# EAGLE design BluetoothAUX (EAGLE 8.3.2)
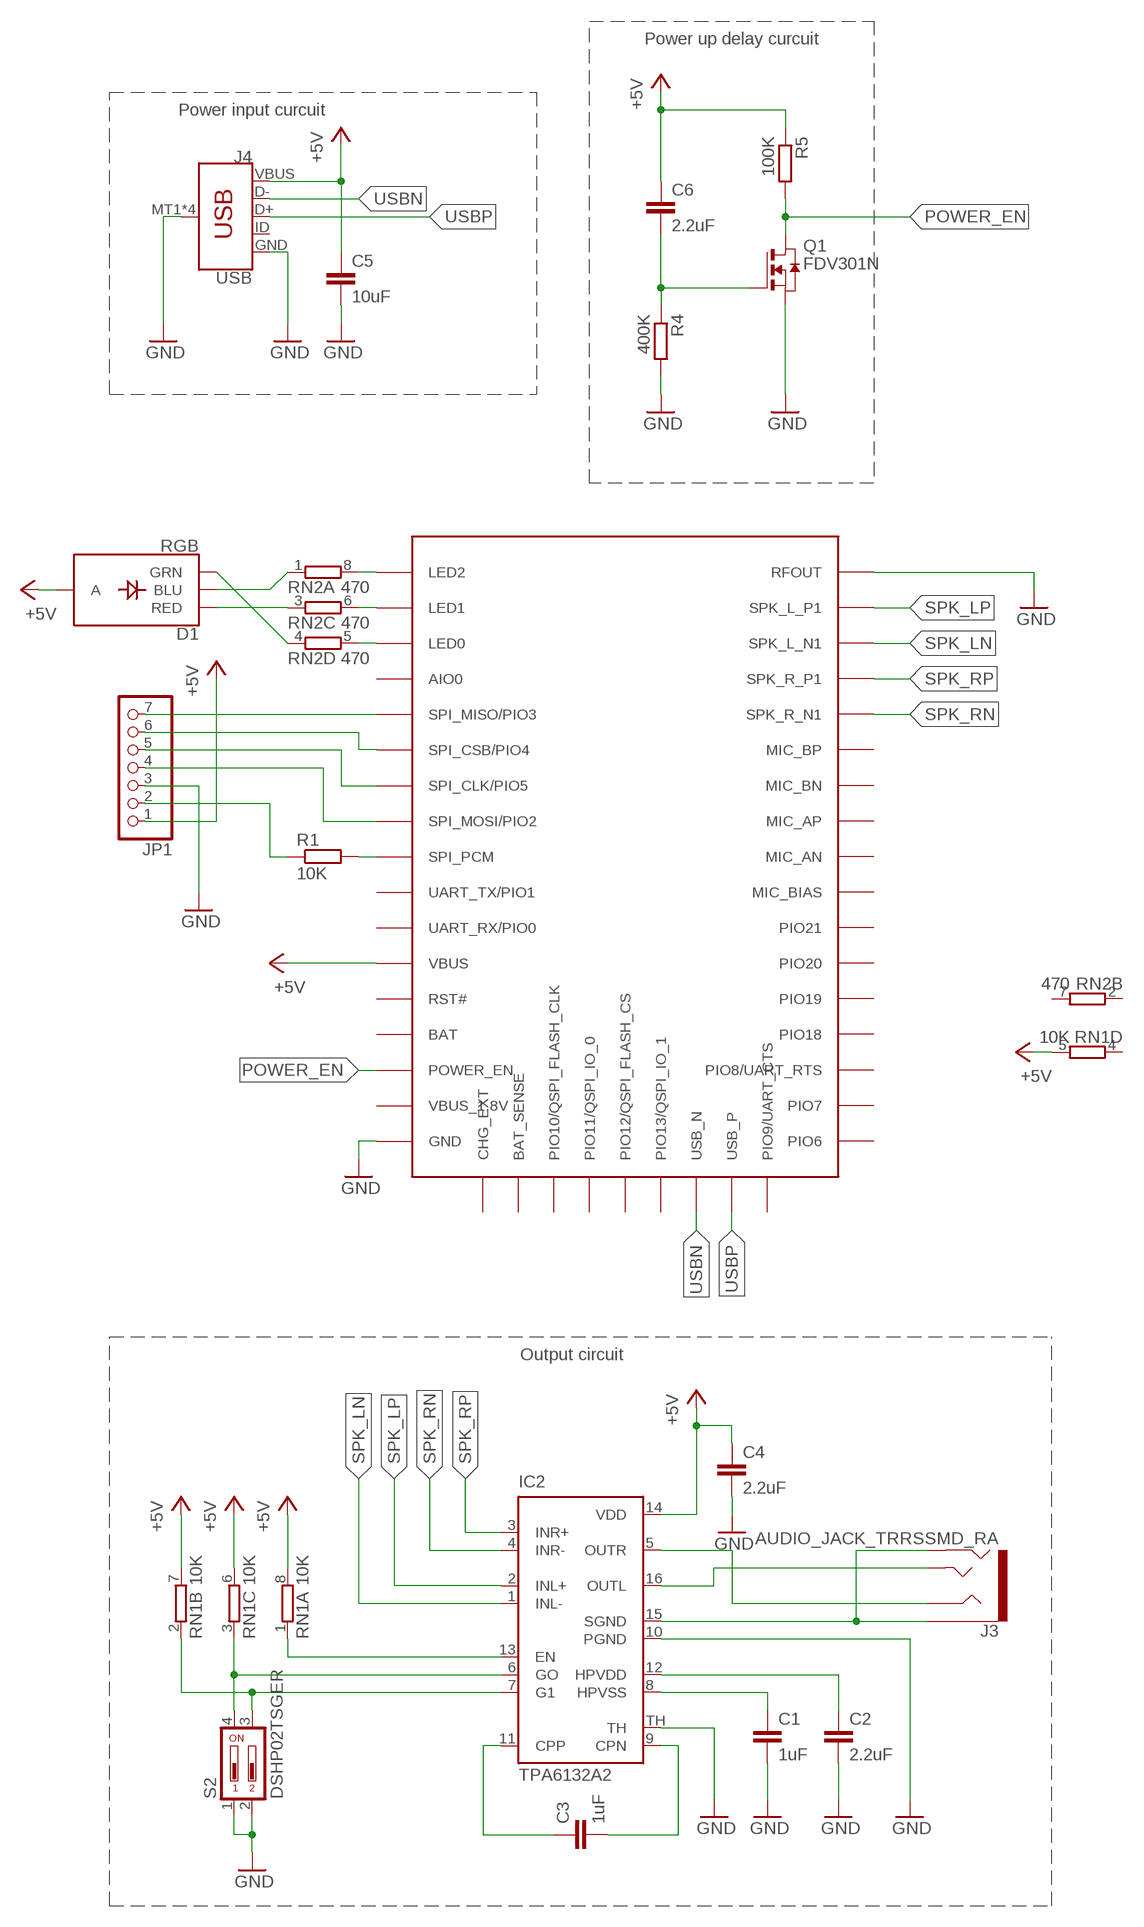
[diagram p0: schematic, sheet 1]

## Parts
C1  1uF  C-EUC0603  [C0603]
C2  2.2uF  C-EUC0603  [C0603]
C3  1uF  C-EUC0603  [C0603]
C4  2.2uF  C-EUC0603  [C0603]
C5  10uF  C-EUC1206  [C1206]
C6  2.2uF  C-EUC0603  [C0603]
D1  RGB  LED-RGB-CAPLCC  [P-LCC-4-3]
IC2  TPA6132A2  [QFN16]
J3  AUDIO_JACK_TRRSSMD_RA  [AUDIO_JACK_3.5MM_TRRS_SMD_RA]
J4  USB  USB_MICRO-B_SMT  [USB-MICROB]
JP1  PINHD-1X7  [1X07]
Q1  FDV301N  [SOT-23]
R1  10K  R-EU_R0603  [R0603]
R4  400K  R-EU_R0603  [R0603]
R5  100K  R-EU_R0603  [R0603]
RN1  10K  4R-N0603-ARC  [0603-ARC]
RN2  470  4R-N0603-ARC  [0603-ARC]
S2  DSHP02TSGER  [DSHP02TSGER]
U$1  F3188  [F3188]

## Nets
+5V [power]: C4.1 C5.1 C6.1 D1.4(A) IC2.14(VDD) J4.VBUS JP1.1 R5.1 RN1.5 RN1.6 RN1.7 RN1.8 U$1.P$12(VBUS)
BLUE: RN2.8 U$1.P$1(LED2)
CLK: JP1.5 U$1.P$7(SPI_CLK/PIO5)
CPN: C3.2 IC2.9(CPN)
CPP: C3.1 IC2.11(CPP)
CS: JP1.6 U$1.P$6(SPI_CSB/PIO4)
G0: IC2.6(GO) RN1.3 S2.4
G1: IC2.7(G1) RN1.2 S2.3
GND [power]: C1.2 C2.2 C4.2 C5.2 IC2.10(PGND) IC2.TH J4.GND J4.MT1(SHIELD) J4.MT2(SHIELD) J4.P$1(SHIELD) J4.P$2(SHIELD) JP1.3 Q1.P$2(S) R4.2 S2.1 S2.2 U$1.P$17(GND) U$1.P$43(RFOUT)
GREEN: RN2.5 U$1.P$3(LED0)
HPVSS: C1.1 IC2.8(HPVSS)
HVPDD: C2.1 IC2.12(HPVDD)
MISO: JP1.7 U$1.P$5(SPI_MISO/PIO3)
MOSI: JP1.4 U$1.P$8(SPI_MOSI/PIO2)
N$1: R1.2 U$1.P$9(SPI_PCM)
N$2: D1.2(GRN) RN2.4
N$3: D1.1(RED) RN2.3
N$4: D1.3(BLU) RN2.1
N$5: C6.2 Q1.P$1(G) R4.1
N$6: JP1.2 R1.1
OUTL: IC2.16(OUTL) J3.TIP
OUTR: IC2.5(OUTR) J3.RING1
POWER_EN: Q1.P$3(D) R5.2 U$1.P$15(POWER_EN)
RED: RN2.6 U$1.P$2(LED1)
SGND [power]: IC2.15(SGND) J3.EARTH J3.RING2
SPK_LN: IC2.1(INL-) U$1.P$41(SPK_L_N1)
SPK_LP: IC2.2(INL+) U$1.P$42(SPK_L_P1)
SPK_RN: IC2.4(INR-) U$1.P$39(SPK_R_N1)
SPK_RP: IC2.3(INR+) U$1.P$40(SPK_R_P1)
TPA_EN: IC2.13(EN) RN1.1
USBN: J4.D- U$1.P$24(USB_N)
USBP: J4.D+ U$1.P$25(USB_P)
Unconnected: J4.ID RN1.4 RN2.2 RN2.7 U$1.P$4(AIO0) U$1.P$10(UART_TX/PIO1) U$1.P$11(UART_RX/PIO0) U$1.P$13(RST#) U$1.P$18(CHG_EXT) U$1.P$19(BAT_SENSE) U$1.P$20(PIO10/QSPI_FLASH_CLK) U$1.P$21(PIO11/QSPI_IO_0) U$1.P$22(PIO12/QSPI_FLASH_CS) U$1.P$23(PIO13/QSPI_IO_1) U$1.P$26(PIO9/UART_CTS) U$1.P$27(PIO6) U$1.P$28(PIO7) U$1.P$29(PIO8/UART_RTS) U$1.P$30(PIO18) U$1.P$31(PIO19) U$1.P$32(PIO20) U$1.P$33(PIO21) U$1.P$34(MIC_BIAS) U$1.P$35(MIC_AN) U$1.P$36(MIC_AP) U$1.P$37(MIC_BN) U$1.P$38(MIC_BP)

## Notes on the sheet
- Power up delay curcuit
- Power input curcuit
- Output circuit

## Power pins joined to a net without a drawn wire
BAT: U$1.P$14(BAT)
VBUS_1.8V: U$1.P$16(VBUS_1.8V)

## Library data of the parts
C1-C4 C6 = resistor:C-EU: CAPACITOR, European symbol
C5 = rcl:C-EU: CAPACITOR, European symbol
D1 = SparkFun-LED:LED-RGB-CA: LED-RGB Diffused Common Anode Packages: LED RGB-THRU P-LCC-4-3 LED-TRICOLOR-SMD SparkFun Products: RGB Diffused Common Anode- Diffuse <[https://www.sparkfun.com/products/10821]> RGB Diffused Common Anode - Clear <[https://www.sparkfun.com/products/10820]> Qduino Mini <[https://www.sparkfun.com/products/13614]> Triple Output LED RGB - SMD <https://www.sparkfun.com/products/7844>; PROD_ID: DIO-12986
IC2 = texas:TPA6132A2: 25-mW DIRECTPATH (TM) STEREO HEADPHONE AMPLIFIER WITH POP SUPPRESSION Source: www.ti.com .. tpa6132a2 direct path stereo $.65.pdf; MPN: TPA6132A2RTET; OC_FARNELL: 1697167; OC_NEWARK: 46P3781
J3 = SparkFun-Connectors:AUDIO_JACK_TRRS: Audio Jack - 3.5mm TRRS (SMD) This is a 3.5mm TRRS SMD audio jack. TRRS connectors are the audio-style connectors that you see on some phones, MP3 players and development boards. TRRS stands for “tip, ring, ring, sleeve,” which reflects that this has three conductors and a ground. SparkFun Products: Audio Jack <https://www.sparkfun.com/products/12639> mbed Starter Kit <https://www.sparkfun.com/products/12968> SparkFun TRRS 3.5mm Jack Breakout <https://www.sparkfun.com/products/11570>; PROD_ID: CONN-10676; SF_ID: PRT-12639
J4 = SparkFun-Connectors:USB_MICRO-B: USB Type Micro-B Connector Male/female and PTH/SMT variants SparkFun Products: SparkFun microB USB Breakout <https://www.sparkfun.com/products/12035> SparkFun USB microB Plug Breakout <https://www.sparkfun.com/products/10031> SparkFun ESP8266 Thing <https://www.sparkfun.com/products/13231>; PROD_ID: CONN-09505; SF_ID: PRT-08533
JP1 = pinhead:PINHD-1X7: PIN HEADER
Q1 = FDV301N:FDV301N: Digital FET, N-Channel This device has been designed especially for low voltage applications as a replacement for digital transistors. 25 V, 0.22 A continuous. 0.5 A peak Rds(on) < 5R @ Vgs 2.7 V. Datasheet <http://datasheet.octopart.com/FDV301N-Fairchild-datasheet-8330556.pdf>; AVAILABILITY: Good; DESCRIPTION: FD V301N Series N-Channel 25 V 4 Ohm Surface Mount Digital FET - SOT-23-3; MF: Fairchild Semiconductor; MP: FDV301N; PACKAGE: SOT-23 Fairchild Semiconductor; PRICE: 0.06 USD
R1 R4 R5 = resistor:R-EU_: RESISTOR, European symbol
RN1 RN2 = resistor-dil:4R-N: Array Chip Resistor Source: RS Component / Phycomp; OC_FARNELL: unknown; OC_NEWARK: unknown
S2 = BluetoothAUX:DSHP02TSGER: Surface Mount DIP Switch Series 219 SMT CTS Electronic Components Sourc: www.ctscorp.com; OC_FARNELL: unknown; OC_NEWARK: unknown
U$1 = BluetoothAUX:F3188

## Net classes
1 power: width 0.305 mm

## Board
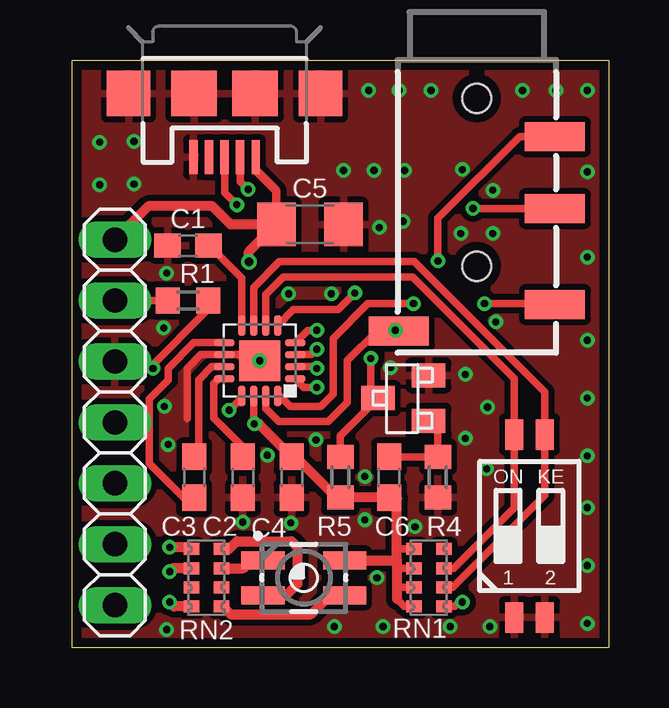
[diagram p1: board, top side]
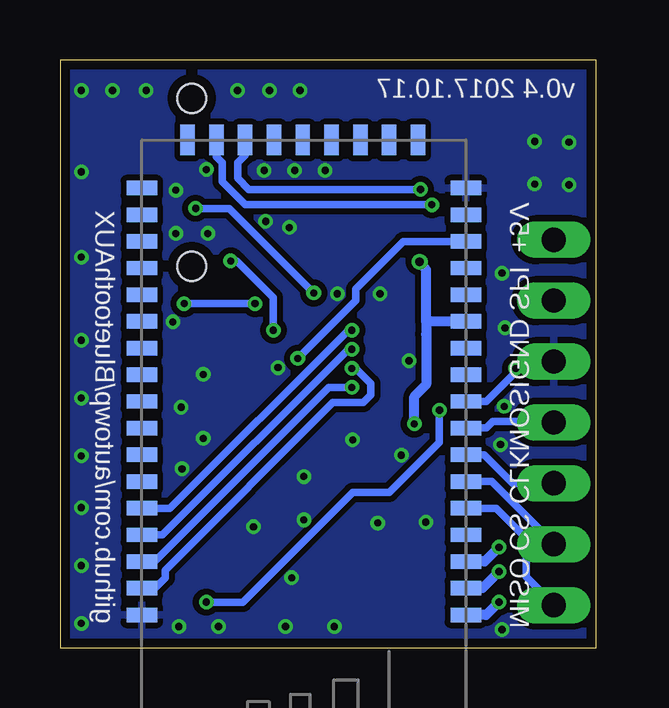
[diagram p2: board, bottom side, seen from below]

Size 22.35 x 24.51 mm. Coordinates in mm from the lower left corner, seen from the top.
Outline: 22.35,0 0,0 0,24.51 22.35,24.5 22.35,0
Copper layers (1*16): Top 0.035mm / dielectric 1.5mm / Bottom 0.035mm
Design rules "NOA Eagle Rule 2016-06-12 *": minimum track width 6mil, minimum drill 0.3mm, track to track 6mil, track to pad 6mil, pad to pad 6mil, via to via 6mil, smd to smd 0mil, copper to edge 0.4mm, drill to drill 10mil, minimum pad ring 10mil, minimum via ring 6mil, stop-mask expansion 2mil, vias tented up to drill 25mil, thermal gap 10mil

### Footprints (pad centres in the part's own frame; a part is rotated, then mirrored left to right if it is on the bottom)
C0603 = smd 1.1 x 1: 1 -0.85,0; 2 0.85,0
C1206 = smd 1.6 x 1.8: 1 -1.4,0; 2 1.4,0
P-LCC-4-3 = smd 1.8 x 0.75: 1 -1.7,0.725; 2 -1.7,-0.725; 3 1.7,-0.725; 4 1.7,0.725
QFN16 = smd 0.85 x 0.3: 1 -1.475,0.75; 2 -1.475,0.25; 3 -1.475,-0.25; 4 -1.475,-0.75; 9 1.475,-0.75; 10 1.475,-0.25; 11 1.475,0.25; 12 1.475,0.75 | smd 0.3 x 0.85: 5 -0.75,-1.475; 6 -0.25,-1.475; 7 0.25,-1.475; 8 0.75,-1.475; 13 0.75,1.475; 14 0.25,1.475; 15 -0.25,1.475; 16 -0.75,1.475 | smd 1.7 x 1.7: TH 0,0
AUDIO_JACK_3.5MM_TRRS_SMD_RA = smd 1.2 x 2.5: EARTH 11.3,-3.25; RING1 6.2,3.25; RING2 3.2,3.25; TIP 10.2,3.25 | hole 1.2: 1.6,0; 8.6,0
USB-MICROB = smd 1.4 x 0.35: D+ -2.65,0; D- -2.65,-0.65; GND -2.65,1.3; ID -2.65,0.65; VBUS -2.65,-1.3 | smd 1.9 x 1.8: MT1 0,-4; MT2 0,4 | smd 1.9 x 1.9: P$1 0,-1.27; P$2 0,1.27
1X07 = drill 1.016 long: 1 -7.62,0; 2 -5.08,0; 3 -2.54,0; 4 0,0; 5 2.54,0; 6 5.08,0; 7 7.62,0
SOT-23 = smd 1 x 1.4: P$1 -0.95,-1.1; P$2 0.95,-1.1; P$3 0,1
R0603 = smd 1 x 1.1: 1 -0.85,0; 2 0.85,0
0603-ARC = smd 0.5 x 0.65: 1 -1.2,-0.625; 2 -0.4,-0.625; 3 0.4,-0.625; 4 1.2,-0.625; 5 1.2,0.625; 6 0.4,0.625; 7 -0.4,0.625; 8 -1.2,0.625
DSHP02TSGER = smd 0.76 x 1.27: 1 -0.635,-3.81; 2 0.635,-3.81; 3 0.635,3.81; 4 -0.635,3.81
F3188 = smd 1.27 x 0.6: P$1 -6.5,7.9; P$2 -6.5,6.787; P$3 -6.5,5.675; P$4 -6.5,4.562; P$5 -6.5,3.45; P$6 -6.5,2.337; P$7 -6.5,1.225; P$8 -6.5,0.113; P$9 -6.5,-1; P$10 -6.5,-2.112; P$11 -6.5,-3.225; P$12 -6.5,-4.338; P$13 -6.5,-5.45; P$14 -6.5,-6.562; P$15 -6.5,-7.675; P$16 -6.5,-8.787; P$17 -6.5,-9.9; P$27 7,-9.9; P$28 7,-8.787; P$29 7,-7.675; P$30 7,-6.562; P$31 7,-5.45; P$32 7,-4.338; P$33 7,-3.225; P$34 7,-2.112; P$35 7,-1; P$36 7,0.113; P$37 7,1.225; P$38 7,2.337; P$39 7,3.45; P$40 7,4.562; P$41 7,5.675; P$42 7,6.787; P$43 7,7.9 | smd 0.6 x 1.27: P$18 -4.5,-11.9; P$19 -3.3,-11.9; P$20 -2.1,-11.9; P$21 -0.9,-11.9; P$22 0.3,-11.9; P$23 1.5,-11.9; P$24 2.7,-11.9; P$25 3.9,-11.9; P$26 5.1,-11.9

### Placement (x,y rotation side)
C1  4.83,16.76 180 top
C2  7.11,7.11 270 top
C3  5.08,7.11 270 top
C4  9.14,7.11 270 top
C5  9.91,17.65 0 top
C6  13.21,7.11 90 top
D1  9.65,2.92 0 top
IC2  7.81,11.97 180 top
J3  16.86,24.51 270 top
J4  6.35,23.11 90 top
JP1  1.78,9.4 270 top
Q1  13.75,10.41 90 top
R1  4.83,14.48 0 top
R4  15.24,7.11 270 top
R5  11.18,7.11 90 top
RN1  14.86,2.92 90 top
RN2  5.59,2.92 90 top
S2  19.05,5.08 0 top
U$1  11.94,9.27 180 bottom

### Tracks (layer width: path | path; a pad name or v marks a point on that pad's centre or on a via)
+5V  (via drill 0.3, 0.35)
  Top 0.305: 7.56,10.03 IC2.14 7.56,9.36 v7.59,9.34 | 8.32,18 C5.1 8.32,18.1 8.13,18.29 | 13.52,6.22 13.46,6.22 | RN1.8 13.84,1.72 13.52,2.03 | RN1.7 13.63,2.52 13.52,2.67 | RN1.6 13.67,3.32 13.52,3.43 | RN1.5 13.71,4.12 13.52,4.19
  Top 0.356: J4.VBUS 7.65,19.91 8.51,19.05 C5.1
  Top 0.406: 8.16,18.32 8.13,18.29 | 13.46,6.22 C6.1 R5.1 11.01,6.26 9.31,7.96 C4.1 8.9,8.22 7.78,9.34 v7.59,9.34 | 13.52,2.03 13.52,2.67 13.52,3.43 13.52,3.65 | 13.52,3.65 13.52,4.19 13.52,6.22 | 11.18,3.72 D1.4 13.52,3.65 | v7.37,16.1 7.37,16.51 C5.1 6.6,17.65 5.84,18.42 3.17,18.42 JP1.1
  Bottom 0.406: v7.37,16.1 7.37,16.04 7.09,15.77 7.09,13.61 | v7.59,9.34 7.59,10.48 7.09,10.97 7.09,13.08 7.09,13.61 | U$1.P$12 7.09,13.61
BLUE  (via drill 0.3)
  Top 0.406: RN2.8 4.25,1.72 v4.06,1.91
  Bottom 0.406: v4.06,1.91 4.6,1.37 U$1.P$1
CLK
  Bottom 0.305: U$1.P$7 4.68,8.05 3.49,6.86 JP1.5
CPN
  Top 0.305: IC2.9 5.07,12.72 4,11.65 4,11.18 3.21,10.38 3.21,7.68 4.63,6.26 C3.2
CPP
  Top 0.305: IC2.11 5.81,11.72 5.27,11.18 5.27,8.47 C3.1
CS
  Bottom 0.305: U$1.P$6 4.36,6.93 1.78,4.35 JP1.6
G0
  Top 0.305: IC2.6 8.06,14.73 8.8,15.46 14.19,15.46 18.41,11.24 S2.4 18.41,5.84 15.89,3.32 RN1.3
G1
  Top 0.305: IC2.7 7.56,15.02 8.64,16.1 14.26,16.1 19.68,10.67 S2.3 19.68,6.35 15.86,2.52 RN1.2
GND  (via drill 0.3)
  Top 0.305: IC2.TH 7.56,12.22 IC2.10 5.36,12.22 4.79,11.65 4.79,9.56
  other vias: 14.95,23.24 16.26,19.94 13.62,23.24 12.35,23.24 20.16,23.24 12.57,19.91 17.53,17.27 21.46,23.24 16.19,17.27 3.84,10.06 1.14,19.3 1.14,21.08 18.76,23.24 21.46,3.43 21.46,5.84 13.27,11.68 7.11,5.24 15.75,0.89 7.81,11.97 14.29,5.05 13.78,17.78 17.53,19.08 2.57,19.34 11.3,19.91 13.84,19.91 12.95,0.89 8.13,8.03 9.11,5.21 4,8.48 12.8,17.53 17.4,0.89 17.3,10.03 21.46,1.02 10.92,0.89 21.46,8 21.46,12.83 21.46,10.41 16.38,11.4 16.38,8.73 17.27,7.46 21.46,19.84 21.46,16.29 10.16,8.67 12.19,7.14 9.02,14.76 10.8,14.76 12.19,5.33 17.65,13.59 12.7,2.92 2.57,21.11 3.94,15.62 3.81,13.33 3.94,0.76
  pour Bottom (isolate 0.254): 22.35,24.51 0,24.51 0,0 22.35,0
  pour Top (isolate 0.254): 22.35,0 22.35,24.51 0,24.51 0,0
GREEN  (via drill 0.3)
  Top 0.406: RN2.5 4.89,4.19 v4.06,4.19
  Bottom 0.406: v4.06,4.19 4.66,3.6 U$1.P$3
HPVSS
  Top 0.305: 7.06,13.92 IC2.8 7.06,15.42 5.71,16.76 C1.1
HVPDD
  Top 0.305: IC2.12 6.11,11.22 5.91,11.02 5.91,9.59 7.15,8.34 C2.1
MISO
  Bottom 0.305: U$1.P$5 4.17,5.82 2.92,4.57 2.92,2.95 1.78,1.81 JP1.7
  Bottom 0.406: 5.4,5.78 U$1.P$5
MOSI
  Bottom 0.305: U$1.P$8 4.59,9.16 4.32,9.43 1.81,9.43 JP1.4
N$1  (via drill 0.3)
  Top 0.305: v3.37,11.65 3.21,11.65 5.68,14.12 R1.2
  Bottom 0.305: U$1.P$9 4.59,10.27 3.37,11.49 v3.37,11.65
N$2
  Top 0.406: RN2.4 6.53,4.12 6.86,4.45 9.14,4.45 9.4,4.19 9.4,2.67 8.93,2.2 D1.2
N$3
  Top 0.406: RN2.3 7.13,3.32 7.37,3.56 7.86,3.56 D1.1
N$4
  Top 0.305: 10.76,2.2 D1.3
  Top 0.406: RN2.1 6.28,1.72 6.6,1.4 9.96,1.4 10.76,2.2
N$5
  Top 0.305: C6.2 R4.1 15.24,9.07 Q1.P$1
N$6
  Top 0.305: R1.1 JP1.2
OUTL  (via drill 0.3)
  Top 0.305: IC2.16 8.65,10.5 9.08,10.07 10.35,10.07 10.87,10.59 10.87,12.91 12.32,14.35 v14.22,14.35 | J3.TIP 20.62,14.35 v17.18,14.35
  Bottom 0.305: v14.22,14.35 v17.18,14.35
OUTR  (via drill 0.3)
  Top 0.305: J3.RING1 17.01,18.31 v16.7,18.32 | IC2.5 9.21,14.1 11.08,14.1 v11.78,14.8
  Bottom 0.305: v16.7,18.32 15.3,18.32 v11.78,14.8
POWER_EN  (via drill 0.3)
  Top 0.305: R5.2 11.18,8.84 Q1.P$3 | Q1.P$3 13.08,10.41 | Q1.P$3 12.45,10.72 v12.45,12.07
  Bottom 0.305: U$1.P$15 8.04,16.95 10.03,14.95 10.03,14.48 v12.45,12.07
RED  (via drill 0.3)
  Top 0.406: RN2.6 4.21,3.32 v4.06,3.18
  Bottom 0.406: v4.06,3.18 4.76,2.48 U$1.P$2
SGND  (via drill 0.3)
  Top 0.305: 8.06,10.18 IC2.15 8.06,9.97 8.6,9.43 10.67,9.43 11.46,10.22 11.46,11.97 12.73,13.24 v13.46,13.24 14.21,13.24 J3.EARTH | J3.RING2 18.64,21.31 15.24,17.91 v15.24,16.13
  Bottom 0.305: v15.24,16.13 14.99,16.13 13.46,14.61 v13.46,13.24
SPK_LN  (via drill 0.3)
  Top 0.305: IC2.1 9.65,10.86 v10.19,10.86
  Bottom 0.305: v10.19,10.86 11.14,10.86 18.41,3.6 U$1.P$41
SPK_LP  (via drill 0.3)
  Top 0.305: IC2.2 10.12,11.72 v10.19,11.65
  Bottom 0.305: v10.19,11.65 10.03,11.65 9.4,11.02 9.4,10.54 9.71,10.22 10.99,10.22 17.97,3.24 17.97,2.92 18.41,2.48 U$1.P$42
SPK_RN  (via drill 0.3)
  Top 0.305: IC2.4 9.81,13.24 v10.19,13.24
  Bottom 0.305: v10.19,13.24 10.35,13.24 17.77,5.82 U$1.P$39
SPK_RP  (via drill 0.3)
  Top 0.305: IC2.3 9.96,12.22 v10.19,12.45
  Bottom 0.305: v10.19,12.45 10.35,12.45 18.09,4.71 U$1.P$40
TPA_EN  (via drill 0.3)
  Top 0.305: IC2.13 7.06,10.43 v6.54,9.91 | v16.26,1.91 16.19,1.98 15.93,1.72 RN1.1
  Bottom 0.305: v16.26,1.91 14.73,1.91 10.16,6.48 8.64,6.48 6.54,8.57 v6.54,9.91
USBN  (via drill 0.3)
  Top 0.305: J4.D- 7,19.45 v7.33,19.11
  Bottom 0.305: v7.33,19.11 14.48,19.11 14.95,19.59 14.95,20.22 14.64,20.54 U$1.P$24
USBP  (via drill 0.3)
  Top 0.305: J4.D+ 6.35,18.99 v6.86,18.48
  Bottom 0.305: v6.86,18.48 14.64,18.48 15.59,19.43 15.59,20.22 15.84,20.47 U$1.P$25

### Text on the board
bNames: v0.4 2017.10.17 | +5V | SPI | GND | MOSI | CLK | CS | MISO | github.com/autowp/BluetoothAUX